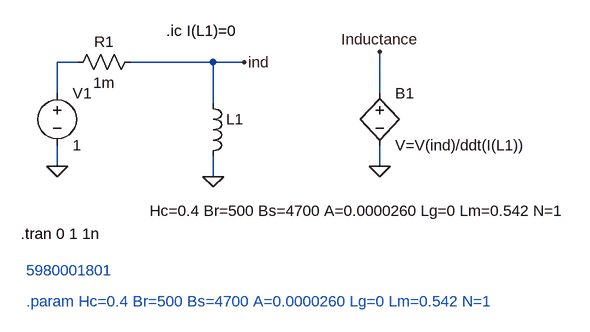
[diagram p0: schematic InductorBench1.asc]
InductorBench1.asc, the LTspice schematic file:
Version 4
SHEET 1 888 680
WIRE -96 80 -128 80
WIRE 112 80 -16 80
WIRE 160 80 112 80
WIRE -128 128 -128 80
WIRE 368 128 368 64
WIRE 112 144 112 80
WIRE -128 240 -128 208
WIRE 368 240 368 208
WIRE 112 256 112 224
FLAG 112 256 0
FLAG -128 240 0
FLAG 160 80 ind
FLAG 368 240 0
FLAG 368 64 Inductance
SYMBOL ind 96 128 R0
WINDOW 3 -82 181 Left 2
SYMATTR InstName L1
SYMATTR Value Hc=0.4 Br=500 Bs=4700 A=0.0000260 Lg=0 Lm=0.542 N=1
SYMBOL bv 368 112 R0
SYMATTR InstName B1
SYMATTR Value V=V(ind)/ddt(I(L1))
SYMBOL voltage -128 112 R0
SYMATTR InstName V1
SYMATTR Value 1
SYMBOL res 0 64 R90
WINDOW 0 0 56 VBottom 2
WINDOW 3 32 56 VTop 2
SYMATTR InstName R1
SYMATTR Value 1m
TEXT -184 344 Left 2 !.tran 0 1 1n
TEXT 40 32 Left 2 !.ic I(L1)=0
TEXT -176 400 Left 2 ;5980001801
TEXT -176 448 Left 2 ;.param Hc=0.4 Br=500 Bs=4700 A=0.0000260 Lg=0 Lm=0.542 N=1

The netlist it stands for:
* InductorBench1.asc
L1 ind 0 Hc=0.4 Br=500 Bs=4700 A=0.0000260 Lg=0 Lm=0.542 N=1
B1 Inductance 0 V=V(ind)/ddt(I(L1))
V1 N001 0 1
R1 ind N001 1m
.tran 0 1 1n
.ic I(L1)=0
* 5980001801
* .param Hc=0.4 Br=500 Bs=4700 A=0.0000260 Lg=0 Lm=0.542 N=1
.backanno
.end